# Altium schematic sheet Arduino_ Connectors.SchDoc: Arduino Uno connector
size A4; Date: 2/4/2015; Author: P.A.; CompanyName: STMicroelectronics; Organization: Microcontrollers Division; Address1: 12, Rue Jules HOROWITZ; Address2: 38019 Grenoble; Address3: FRANCE; DocumentNumber: MB1209; Revision: D-02; SheetNumber: 10; SheetTotal: 11; Project: STM32F412G-DISCO; ModifiedDate: 6/2/2016
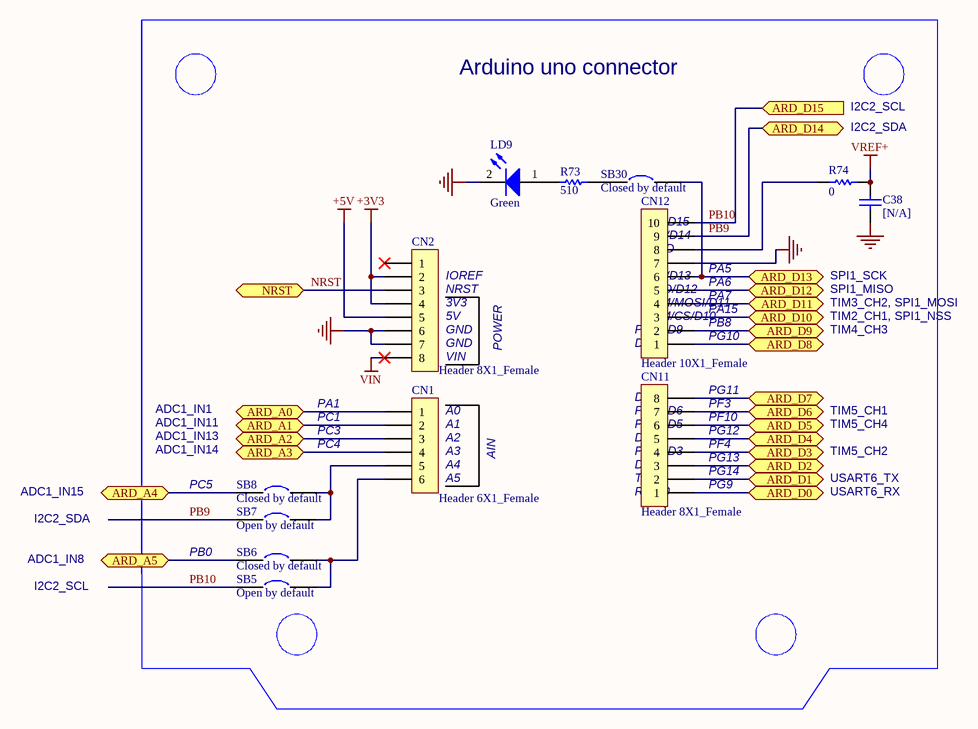
[diagram p0: Arduino_ Connectors.SchDoc]

## Parts
C38  [N/A]  [0603C]
CN1  Header 6X1_Female  [HDR_1X6_2R54_W]
CN2  Header 8X1_Female  [HDR_1X8_2R54_W]
CN11  Header 8X1_Female  [HDR_1X8_2R54_W]
CN12  Header 10X1_Female  [HDR_1X10_2R54_W]
LD9  Green  [0603D]
R73  510  [0603R]
R74  0  [SB_0603]
SB5  Open by default  [SB_0603]
SB6  Closed by default  [SB_0603]
SB7  Open by default  [SB_0603]
SB8  Closed by default  [SB_0603]
SB30  Closed by default  [SB_0603]

## Ports
ARD_A0 (bidir), ARD_A1 (bidir), ARD_A2 (bidir), ARD_A3 (bidir), ARD_A4 (bidir), ARD_A5 (bidir), ARD_D0 (bidir), ARD_D1 (bidir), ARD_D2 (bidir), ARD_D3 (bidir), ARD_D4 (bidir), ARD_D5 (bidir), ARD_D6 (bidir), ARD_D7 (bidir), ARD_D8 (bidir), ARD_D9 (bidir), ARD_D10 (bidir), ARD_D11 (bidir), ARD_D12 (bidir), ARD_D13 (bidir), ARD_D14 (bidir), ARD_D15 (in), NRST (bidir)

## Nets
+3V3: CN2.2 CN2.4
+5V: CN2.5
GND: C38.1 CN2.6 CN2.7 CN12.7 LD9.2(K)
VIN: CN2.8
VREF+: C38.2 R74.1
ARD_A0: CN1.1 ; port ARD_A0
ARD_A1: CN1.2 ; port ARD_A1
ARD_A2: CN1.3 ; port ARD_A2
ARD_A3: CN1.4 ; port ARD_A3
ARD_A4: SB8.1 ; port ARD_A4
ARD_A5: SB6.1 ; port ARD_A5
ARD_D0: CN11.1 ; port ARD_D0
ARD_D1: CN11.2 ; port ARD_D1
ARD_D2: CN11.3 ; port ARD_D2
ARD_D3: CN11.4 ; port ARD_D3
ARD_D4: CN11.5 ; port ARD_D4
ARD_D5: CN11.6 ; port ARD_D5
ARD_D6: CN11.7 ; port ARD_D6
ARD_D7: CN11.8 ; port ARD_D7
ARD_D8: CN12.1 ; port ARD_D8
ARD_D9: CN12.2 ; port ARD_D9
ARD_D10: CN12.3 ; port ARD_D10
ARD_D11: CN12.4 ; port ARD_D11
ARD_D12: CN12.5 ; port ARD_D12
ARD_D13: CN12.6 SB30.2 ; port ARD_D13
NRST: CN2.3 ; port NRST
PB9: CN12.9 SB7.1 ; port ARD_D14
PB10: CN12.10 SB5.1 ; port ARD_D15
NetCN1_5: CN1.5 SB7.2 SB8.2
NetCN1_6: CN1.6 SB5.2 SB6.2
NetCN12_8: CN12.8 R74.2
NetLD9_1: LD9.1(A) R73.2
NetR73_1: R73.1 SB30.1

Not connected (* = marked no-connect by the designer): CN2 1*

## Notes on the sheet
- Arduino uno connector
- I2C2_SCL
- I2C2_SDA
- (near CN12) SDA/D14
- SCL/D15
- (near CN12) AVDD
- (near CN2) IOREF
- (near CN2) NRST
- (near CN2) 3V3
- (near CN12) SCK/D13
- (near CN12) MISO/D12
- (near CN12) PWM/MOSI/D11
- (near CN12) GND
- (near CN12) PA15
- (near CN12) PA7
- (near CN12) PA6
- (near CN12) PA5
- TIM3_CH2, SPI1_MOSI
- SPI1_MISO
- SPI1_SCK
- (near CN2) 5V
- (near CN2) GND
- (near CN2) VIN
- POWER
- (near CN12) D8
- (near CN12) PWM/D9
- (near CN12) PWM/CS/D10
- (near CN12) PG10
- (near CN12) PB8
- TIM4_CH3
- TIM2_CH1, SPI1_NSS
- ADC1_IN14
- ADC1_IN13
- ADC1_IN11
- ADC1_IN1
- PA1
- PC1
- PC3
- PC4
- (near CN1) A0
- (near CN1) A1
- (near CN1) A2
- (near CN11) D4
- (near CN11) PWM/D5
- (near CN11) PWM/D6
- (near CN11) D7
- (near CN11) PG12
- (near CN11) PF10
- (near CN11) PF3
- PG11
- (near CN11) PF4
- TIM5_CH4
- TIM5_CH1
- ADC1_IN15
- PC5
- (near CN1) A3
- (near CN1) A4
- (near CN1) A5
- AIN
- (near CN11) RX/D0
- (near CN11) TX/D1
- (near CN11) D2
- (near CN11) PWM/D3
- (near CN11) PG9
- (near CN11) PG14
- (near CN11) PG13
- USART6_RX
- USART6_TX
- TIM5_CH2
- ADC1_IN8
- PB0
- Title:
- Project:
- Size:
- Date:
- Reference:
- Sheet:
- Revision:
- of

## Library data of the parts
C38 = Cap: Capacitor; Value: 10nF; Ordered by: Subcon; Fitted: NO; ECCN_US/EU: NA; Published: 8-Jun-2000; Revision: July-2002: Re-released for DXP Platform.; Publisher: Altium Limited
CN1 = Header 6X1_Female: Header, 6-Pin, Single row,female; Ordered by: Subcon; ECCN_US/EU: NA; LatestRevisionDate: 17-Jul-2002; LatestRevisionNote: Re-released for DXP Platform.; Publisher: Altium Limited
CN2 CN11 = Header 8X1_Female: Header, 8-Pin, Single row,female; Ordered by: Subcon; ECCN_US/EU: NA; LatestRevisionDate: 17-Jul-2002; LatestRevisionNote: Re-released for DXP Platform.; Publisher: Altium Limited
CN12 = Header 10X1_Female: Header, 10-Pin, Single row,female; Ordered by: Subcon; ECCN_US/EU: NA; LatestRevisionDate: 17-Jul-2002; LatestRevisionNote: Re-released for DXP Platform.; Publisher: Altium Limited
LD9 = LED2: Typical RED, GREEN, YELLOW, AMBER GaAs LED; Ordered by: Subcon; ECCN_US/EU: EAR99/NEC; Published: 8-Jun-2000; Revision: July-2002: Re-released for DXP Platform.; Publisher: Altium Limited
R73 R74 = Res1: Resistor; Value: 1K; Ordered by: Subcon; ECCN_US/EU: NA; Published: 8-Jun-2000; Revision: July-2002: Re-released for DXP Platform.; Publisher: Altium Limited
SB5 SB7 = Circuit Breaker: Ordered by: Subcon; Comments: Solder bridge; Fitted: NO; ECCN_US/EU: NA; Published: 24-Mar-1999; Revision: July-2002: Re-released for DXP Platform.; Publisher: Altium Limited
SB6 SB8 SB30 = Circuit Breaker: Ordered by: Subcon; Comments: Solder bridge; ECCN_US/EU: NA; Published: 24-Mar-1999; Revision: July-2002: Re-released for DXP Platform.; Publisher: Altium Limited